# Altium project rtls_tag.PrjPcb
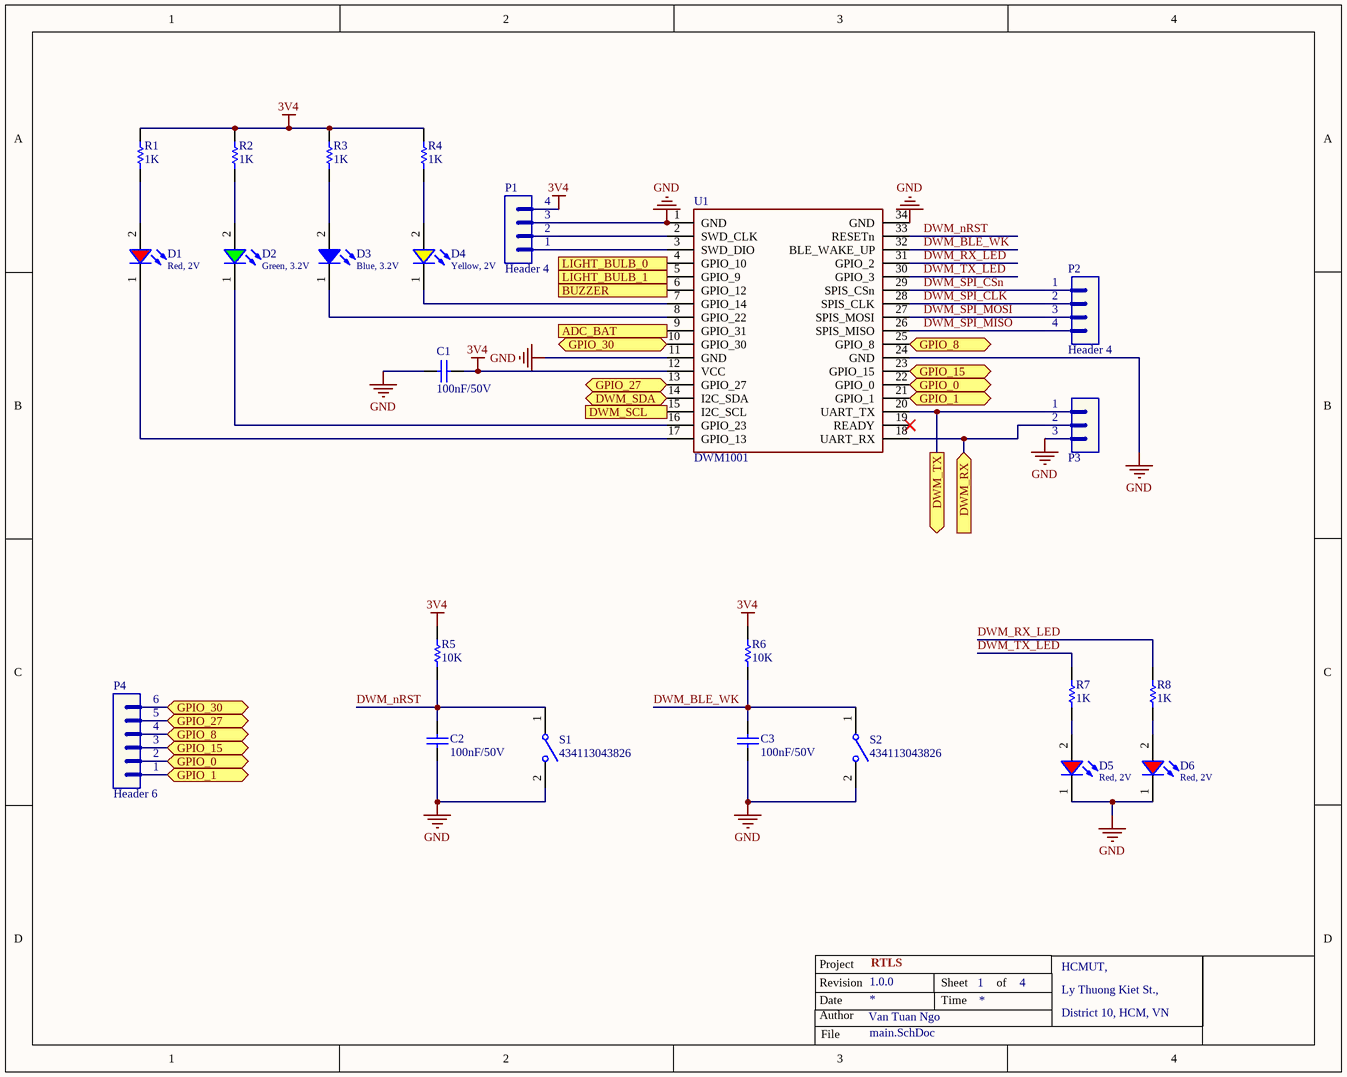
[diagram p0: main.SchDoc]
4 sheets, 85 parts. Net scope: flat (ports and power ports of the same name join across sheets).
Board file: rtls_tag.PcbDoc
Sheets:
  main.SchDoc
  power_supply.SchDoc
  serial.SchDoc
  wifi.SchDoc

## Sheet main.SchDoc
size OrCAD A; DrawnBy: Van Tuan Ngo; Organization: PIF Club; Address1: HCMUT,; Address2: Ly Thuong Kiet St.,; Address3: District 10, HCM, VN; DocumentNumber: 1; Revision: 1.0.0; SheetNumber: 1; SheetTotal: 4; Project: RTLS

### Parts
C1  value 100nF/50V  [CAP-SM-0805]  (hidden comment: Cap-100nF-50V-0805)
C2  value 100nF/50V  [CAP-SM-0805]  (hidden comment: Cap-100nF-50V-0805)
C3  value 100nF/50V  [CAP-SM-0805]  (hidden comment: Cap-100nF-50V-0805)
D1  Red, 2V  [WL-SMCW_0805]
D2  Green, 3.2V  [WL-SMCW_0805]
D3  Blue, 3.2V  [WL-SMCW_0805]
D4  Yellow, 2V  [WL-SMCW_0805]
D5  Red, 2V  [WL-SMCW_0805]
D6  Red, 2V  [WL-SMCW_0805]
P1  Header 4  [JP4]
P2  Header 4  [JP4]
P3  Header 3  [JP3]  (value not drawn)
P4  Header 6  [JP6]
R1  value 1K  [RES-SM-0805]  (hidden comment: Res-1K-0805)
R2  value 1K  [RES-SM-0805]  (hidden comment: Res-1K-0805)
R3  value 1K  [RES-SM-0805]  (hidden comment: Res-1K-0805)
R4  value 1K  [RES-SM-0805]  (hidden comment: Res-1K-0805)
R5  value 10K  [RES-SM-0805]  (hidden comment: Res-10k-0805)
R6  value 10K  [RES-SM-0805]  (hidden comment: Res-10k-0805)
R7  value 1K  [RES-SM-0805]  (hidden comment: Res-1K-0805)
R8  value 1K  [RES-SM-0805]  (hidden comment: Res-1K-0805)
S1  434113043826  [434113043826]
S2  434113043826  [434113043826]
U1  DWM1001  [DWM1001]

### Ports
ADC_BAT (in), BUZZER (out), DWM_RX (in), DWM_SCL (out), DWM_SDA (bidir), DWM_TX (out), GPIO_0 (bidir), GPIO_1 (bidir), GPIO_8 (bidir), GPIO_15 (bidir), GPIO_27 (bidir), GPIO_30 (bidir), LIGHT_BULB_0 (out), LIGHT_BULB_1 (out)

### Nets
3V4: C1.2 P1.4 R1.1 R2.1 R3.1 R4.1 R5.2 R6.2 U1.12(VCC)
GND: C1.1 C2.1 C3.1 D5.1(K) D6.1(K) P1.3 P3.3 S1.2 S2.2 U1.1(GND) U1.11(GND) U1.24(GND) U1.34(GND)
DWM_BLE_WK: C3.2 R6.1 S2.1 U1.32(BLE_WAKE_UP)
DWM_nRST: C2.2 R5.1 S1.1 U1.33(RESETn)
DWM_RX_LED: R8.1 U1.31(GPIO_2)
DWM_SPI_CLK: P2.2 U1.28(SPIS_CLK)
DWM_SPI_CSn: P2.1 U1.29(SPIS_CSn)
DWM_SPI_MISO: P2.4 U1.26(SPIS_MISO)
DWM_SPI_MOSI: P2.3 U1.27(SPIS_MOSI)
DWM_TX_LED: R7.1 U1.30(GPIO_3)
ESP_TX: P3.2 U1.18(UART_RX) ; port DWM_RX
NetD1_1: D1.1(K) U1.17(GPIO_13)
NetD1_2: D1.2(A) R1.2
NetD2_1: D2.1(K) U1.16(GPIO_23)
NetD2_2: D2.2(A) R2.2
NetD3_1: D3.1(K) U1.8(GPIO_22)
NetD3_2: D3.2(A) R3.2
NetD4_1: D4.1(K) U1.7(GPIO_14)
NetD4_2: D4.2(A) R4.2
NetD5_2: D5.2(A) R7.2
NetD6_2: D6.2(A) R8.2
NetP1_1: P1.1 U1.3(SWD_DIO)
NetP1_2: P1.2 U1.2(SWD_CLK)
NetP3_1: P3.1 U1.20(UART_TX) ; port DWM_TX
NetP4_1: P4.1 U1.21(GPIO_1) ; port GPIO_1
NetP4_2: P4.2 U1.22(GPIO_0) ; port GPIO_0
NetP4_3: P4.3 U1.23(GPIO_15) ; port GPIO_15
NetP4_4: P4.4 U1.25(GPIO_8) ; port GPIO_8
NetP4_5: P4.5 U1.13(GPIO_27) ; port GPIO_27
NetP4_6: P4.6 U1.10(GPIO_30) ; port GPIO_30
NetR17_1: U1.9(GPIO_31) ; port ADC_BAT
NetU1_4: U1.4(GPIO_10) ; port LIGHT_BULB_0
NetU1_5: U1.5(GPIO_9) ; port LIGHT_BULB_1
NetU1_6: U1.6(GPIO_12) ; port BUZZER
NetU1_14: U1.14(I2C_SDA) ; port DWM_SDA
NetU1_15: U1.15(I2C_SCL) ; port DWM_SCL

Not connected (* = marked no-connect by the designer): U1 19(READY)*

### Notes on the sheet
- Project
- Revision
- Date
- Author
- Sheet
- Time
- of
- File

### Library data of the parts
C1-C3 = Cap-100nF-50V-0805: CAP CER 0.1UF 50V Y5V 0805; Manufacturer: Samsung Electro-Mechanics; Manufacturer Part Number: CL21F104ZBCNNNC; Local Supplier: thegioiic; Local Supplier Link: https://www.thegioiic.com/products/tu-gom-0805-100nf-0-1uf-50v; Supplier 1: Digikey; Supplier 1 Part Number: 1276-1007-1-ND; Supplier 1 Link: https://www.digikey.com/product-detail/en/samsung-electro-mechanics/CL21F104ZBCNNNC/1276-1007-1-ND/3889093
D1 D5 D6 = 150080RS75000: WL-SMCW SMT Mono-color Chip LED Waterclear, size 0805, Red, 2V, 140deg; Chip Technology: AlInGaP; Dominant Wavelength typ.: 625nm; Luminous Intensity typ.: 150mcd; Peak Wavelength typ.: 630nm; Viewing Angle: 140deg; ComponentLink1Description: Manufacturer; ComponentLink1URL: http://www.we-online.de; ComponentLink2URL: https://www.we-online.com/catalog/datasheet/150080RS75000.pdf; ComponentLink2Description: Datasheet; Forward Voltage typ.: 2V; Emitting Color: Red; Mounting Technology: SMT; Operating Temperature: -40 to +85degC; Published Date: December 2019; Part Number: 150080RS75000; Packaging: Tape and Reel; Size: 0805; Publisher: Wurth Elektronik
D2 = 150080GS75000: WL-SMCW SMT Mono-color Chip LED Waterclear, size 0805, Green, 3.2V, 140deg; Chip Technology: InGaN; Dominant Wavelength typ.: 525nm; Luminous Intensity typ.: 450mcd; Peak Wavelength typ.: 515nm; Viewing Angle: 140deg; ComponentLink1Description: Manufacturer; ComponentLink1URL: http://www.we-online.de; ComponentLink2URL: https://www.we-online.com/catalog/datasheet/150080GS75000.pdf; ComponentLink2Description: Datasheet; Forward Voltage typ.: 3.2V; Emitting Color: Green; Mounting Technology: SMT; Operating Temperature: -40 to +85degC; Published Date: December 2019; Part Number: 150080GS75000; Packaging: Tape and Reel; Size: 0805; Publisher: Wurth Elektronik
D3 = 150080BS75000: WL-SMCW SMT Mono-color Chip LED Waterclear, size 0805, Blue, 3.2V, 140deg; Chip Technology: InGaN; Dominant Wavelength typ.: 470nm; Luminous Intensity typ.: 145mcd; Peak Wavelength typ.: 465nm; Viewing Angle: 140deg; ComponentLink1Description: Manufacturer; ComponentLink1URL: http://www.we-online.de; ComponentLink2URL: https://www.we-online.com/catalog/datasheet/150080BS75000.pdf; ComponentLink2Description: Datasheet; Forward Voltage typ.: 3.2V; Emitting Color: Blue; Mounting Technology: SMT; Operating Temperature: -40 to +85degC; Published Date: December 2019; Part Number: 150080BS75000; Packaging: Tape and Reel; Size: 0805; Publisher: Wurth Elektronik
D4 = 150080YS75000: WL-SMCW SMT Mono-color Chip LED Waterclear, size 0805, Yellow, 2V, 140deg; Chip Technology: AlInGaP; Dominant Wavelength typ.: 590nm; Luminous Intensity typ.: 120mcd; Peak Wavelength typ.: 595nm; Viewing Angle: 140deg; ComponentLink1Description: Manufacturer; ComponentLink1URL: http://www.we-online.de; ComponentLink2URL: https://www.we-online.com/catalog/datasheet/150080YS75000.pdf; ComponentLink2Description: Datasheet; Forward Voltage typ.: 2V; Emitting Color: Yellow; Mounting Technology: SMT; Operating Temperature: -40 to +85degC; Published Date: December 2019; Part Number: 150080YS75000; Packaging: Tape and Reel; Size: 0805; Publisher: Wurth Elektronik
P1 P2 = Header 4: Header, 4-Pin; LatestRevisionDate: 17-Jul-2002; LatestRevisionNote: Re-released for DXP Platform.; Publisher: Altium Limited; Local Supplier: thegioiic; Local Supplier Part Number: x; Local Supplier Link: https://www.thegioiic.com/products/hang-rao-duc-don-2-54mm-40-chan-1-hang-cao-11-4mm-xuyen-lo
P3 = Header 3: Header, 3-Pin; LatestRevisionDate: 17-Jul-2002; LatestRevisionNote: Re-released for DXP Platform.; Publisher: Altium Limited; Local Supplier: thegioiic; Local Supplier Part Number: x; Local Supplier Link: https://www.thegioiic.com/products/hang-rao-duc-don-2-54mm-40-chan-1-hang-cao-11-4mm-xuyen-lo
P4 = Header 6: Header, 6-Pin; LatestRevisionDate: 17-Jul-2002; LatestRevisionNote: Re-released for DXP Platform.; Publisher: Altium Limited; Local Supplier Link: https://www.thegioiic.com/products/hang-rao-duc-don-2-54mm-40-chan-1-hang-cao-11-4mm-xuyen-lo; Local Supplier: thegioiic; Local Supplier Part Number: x
R1-R4 R7 R8 = Res-1K-0805: RES 1K OHM 1% 1/4W 0805; Manufacturer: Stackpole Electronics Inc; Manufacturer Part Number: RNCP0805FTD1K00; Local Supplier: thegioiic; Local Supplier Link: https://www.thegioiic.com/products/dien-tro-1-kohm-0805-5; Supplier 1: Digikey; Supplier 1 Link: https://www.digikey.com/product-detail/en/stackpole-electronics-inc/RNCP0805FTD1K00/RNCP0805FTD1K00CT-ND/2240568; Supplier 1 Part Number: RNCP0805FTD1K00CT-ND
R5 R6 = Res-10k-0805: RES 10K OHM 1% 1/4W 0805; Manufacturer: Stackpole Electronics Inc; Manufacturer Part Number: RNCP0805FTD10K0; Local Supplier: thegioiic; Local Supplier Link: https://www.thegioiic.com/products/dien-tro-10-kohm-0805-5; Supplier 1: Digikey; Supplier 1 Link: https://www.digikey.com/product-detail/en/stackpole-electronics-inc/RNCP0805FTD10K0/RNCP0805FTD10K0CT-ND/2240601; Supplier 1 Part Number: RNCP0805FTD10K0CT-ND
S1 S2 = 434113043826: WS-TASV J-Bend SMT Tact Switch 6x3.5mm, height 4.3mm, 260gf; Rated Voltage: 12VDC; Rated Current: 50mA; Washable: No; ComponentLink1Description: Manufacturer; ComponentLink1URL: http://www.we-online.de; ComponentLink2Description: Datasheet; ComponentLink2URL: https://katalog.we-online.com/em/datasheet/434113043826.pdf; Operating Temperature: -40 to +85degC; Part Number: 434113043826; Published Date: September 2019; Contact Material: Stainless Steel; Height: 4.3mm; Mounting Technology: SMT; Contact Plating: Silver; Operation Force: 260gf; Packaging: Tape and Reel; Terminal Material: Copper Alloy; Publisher: Wurth Elektronik; Terminal Plating: Silver; Local Supplier: thegioiic; Local Supplier Link: https://www.thegioiic.com/products/nut-nhan-3-5x6mm-cao-5mm-2-chan-smd-dau-trang; Local Supplier Part Number: x
U1 = DWM1001: Local Supplier: x; Local Supplier Part Number: x; Local Supplier Link: x

## Sheet power_supply.SchDoc
size OrCAD A; DrawnBy: Van Tuan Ngo; Organization: PIF Club; Address1: HCMUT,; Address2: Ly Thuong Kiet St.,; Address3: District 10, HCM, VN; DocumentNumber: 2; Revision: 1.0.0; SheetNumber: 2; SheetTotal: 4; Project: RTLS
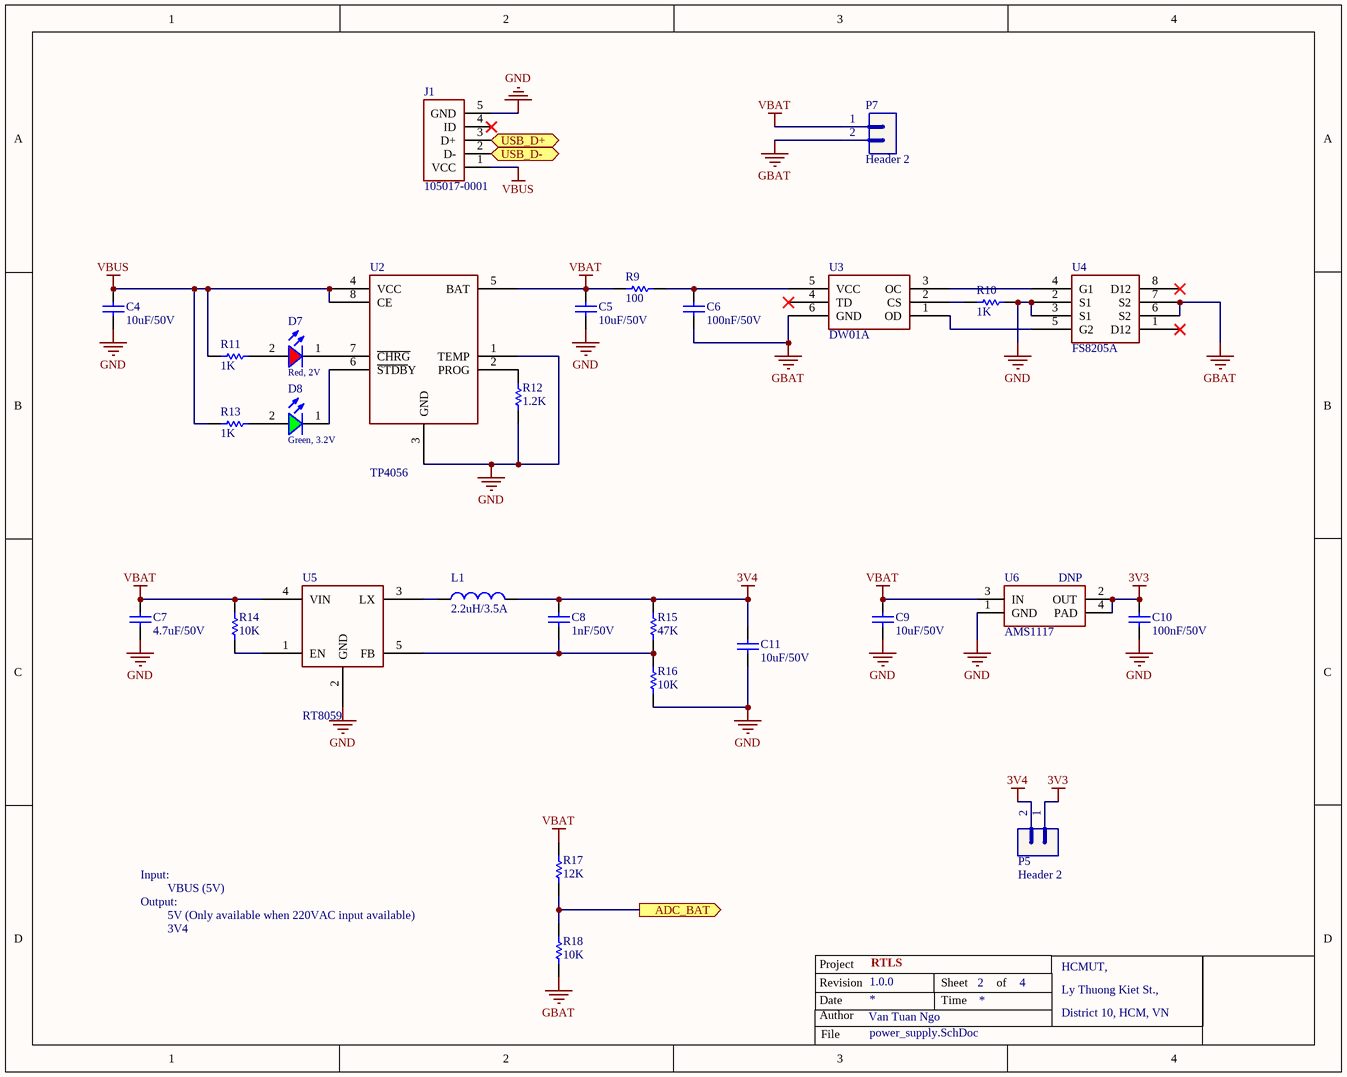
[diagram p1: power_supply.SchDoc]

### Parts
C4  value 10uF/50V  [CAP-SM-0805]  (hidden comment: Cap-10uF-50V-0805)
C5  value 10uF/50V  [CAP-SM-0805]  (hidden comment: Cap-10uF-50V-0805)
C6  value 100nF/50V  [CAP-SM-0805]  (hidden comment: Cap-100nF-50V-0805)
C7  value 4.7uF/50V  [CAP-SM-0805]  (hidden comment: Cap-4.7uF-50V-0805)
C8  value 1nF/50V  [CAP-SM-0805]  (hidden comment: Cap-22pF-50V-0805)
C9  value 10uF/50V  [CAP-SM-0805]  (hidden comment: Cap-10uF-50V-0805)
C10  value 100nF/50V  [CAP-SM-0805]  (hidden comment: Cap-100nF-50V-0805)
C11  value 10uF/50V  [CAP-SM-0805]  (hidden comment: Cap-10uF-50V-0805)
D7  Red, 2V  [WL-SMCW_0805]
D8  Green, 3.2V  [WL-SMCW_0805]
J1  105017-0001  [Micro-USB-Female]
L1  2.2uH/3.5A  [CD53]
P5  Header 2  [JP2]
P7  Header 2  [JP2]
R9  value 100  [RES-SM-0805]  (hidden comment: Res-100-0805)
R10  value 1K  [RES-SM-0805]  (hidden comment: Res-1K-0805)
R11  value 1K  [RES-SM-0805]  (hidden comment: Res-1K-0805)
R12  value 1.2K  [RES-SM-0805]  (hidden comment: Res-1.2K-0805)
R13  value 1K  [RES-SM-0805]  (hidden comment: Res-1K-0805)
R14  value 10K  [RES-SM-0805]  (hidden comment: Res-10k-0805)
R15  value 47K  [RES-SM-0805]  (hidden comment: Res-47K-0805)
R16  value 10K  [RES-SM-0805]  (hidden comment: Res-10k-0805)
R17  value 12K  [RES-SM-0805]  (hidden comment: Res-12K-0805)
R18  value 10K  [RES-SM-0805]  (hidden comment: Res-10k-0805)
U2  TP4056  [SOP8]
U3  DW01A  [SOT-23-6]
U4  FS8205A  [TSSOP8]
U5  RT8059  [SOT-23-5]
U6  AMS1117  [SOT223]

### Ports
ADC_BAT (out), USB_D+ (bidir), USB_D- (bidir)

### Nets
3V3: C10.2 P5.1 U6.2(OUT) U6.4(PAD)
3V4: C8.2 C11.2 L1.2 P5.2 R15.2
GBAT: C6.1 P7.2 R18.1 U3.6(GND) U4.6(S2) U4.7(S2)
GND: C4.1 C5.1 C7.1 C9.1 C10.1 C11.1 J1.5(GND) R10.2 R12.1 R16.1 U2.1(TEMP) U2.3(GND) U4.2(S1) U4.3(S1) U5.2(GND) U6.1(GND)
VBAT: C5.2 C7.2 C9.2 P7.1 R9.1 R14.2 R17.2 U2.5(BAT) U5.4(VIN) U6.3(IN)
VBUS: C4.2 J1.1(VCC) R11.1 R13.1 U2.4(VCC) U2.8(CE)
NetC6_2: C6.2 R9.2 U3.5(VCC)
NetC8_1: C8.1 R15.1 R16.2 U5.5(FB)
NetD7_1: D7.1(K) U2.7(~{CHRG})
NetD7_2: D7.2(A) R11.2
NetD8_1: D8.1(K) U2.6(~{STDB}Y)
NetD8_2: D8.2(A) R13.2
NetJ1_2: J1.2(D-) ; port USB_D-
NetJ1_3: J1.3(D+) ; port USB_D+
NetL1_1: L1.1 U5.3(LX)
NetR10_1: R10.1 U3.2(CS)
NetR12_2: R12.2 U2.2(PROG)
NetR14_1: R14.1 U5.1(EN)
NetR17_1: R17.1 R18.2 ; port ADC_BAT
NetU3_1: U3.1(OD) U4.5(G2)
NetU3_3: U3.3(OC) U4.4(G1)

Not connected (* = marked no-connect by the designer): J1 4(ID)*; U3 4(TD)*; U4 1(D12)* 8(D12)*

### Notes on the sheet
- (near U6) DNP
- Input:
- VBUS (5V)
- Output:
- 3V4
- 5V (Only available when 220VAC input available)
- Project
- Revision
- Date
- Author
- Sheet
- Time
- of
- File

### Library data of the parts
C4 C5 C9 C11 = Cap-10uF-50V-0805: CAP CER 10UF 50V X5R 0805; Manufacturer: Yageo; Manufacturer Part Number: CC0805KKX5R9BB106; Local Supplier: thegioiic; Local Supplier Link: https://www.thegioiic.com/products/tu-gom-0805-10uf-50v; Supplier 1: Digikey; Supplier 1 Link: https://www.digikey.com/product-detail/en/yageo/CC0805KKX5R9BB106/311-3499-2-ND/7164383; Supplier 1 Part Number: 311-3499-2-ND
C6 C10 = Cap-100nF-50V-0805: as C1 on sheet main; Local Supplier: thegioiic; Local Supplier Link: https://www.thegioiic.com/products/tu-gom-0805-100nf-0-1uf-50v; Supplier 1: Digikey; Supplier 1 Part Number: 1276-1007-1-ND; Supplier 1 Link: https://www.digikey.com/product-detail/en/samsung-electro-mechanics/CL21F104ZBCNNNC/1276-1007-1-ND/3889093
C7 = Cap-4.7uF-50V-0805: CAP CER 4.7UF 50V X5R 0805; Manufacturer: Murata Electronics; Manufacturer Part Number: GRM21BR61H475KE51L; Local Supplier: thegioiic; Local Supplier Link: https://thegioiic.com/products/tu-4-7uf-50v-0805-cap; Supplier 1: Digikey; Supplier 1 Link: https://www.digikey.com/product-detail/en/murata-electronics/GRM21BR61H475KE51L/490-10751-1-ND/5251349; Supplier 1 Part Number: 490-10751-1-ND
C8 = Cap-22pF-50V-0805: CAP CER 22PF 100V X7R 0805; Manufacturer: Johanson Dielectrics Inc.; Manufacturer Part Number: 101X15W102MV4E; Local Supplier: thegioiic; Local Supplier Link: https://thegioiic.com/products/tu-1nf-50v-0805; Supplier 1: Digikey; Supplier 1 Link: https://www.digikey.com/product-detail/en/johanson-dielectrics-inc/101X15W102MV4E/709-1335-1-ND/2327235; Supplier 1 Part Number: 709-1335-1-ND
D7 = 150080RS75000: as D1 on sheet main; Viewing Angle: 140deg; ComponentLink1Description: Manufacturer; ComponentLink1URL: http://www.we-online.de; ComponentLink2URL: https://www.we-online.com/catalog/datasheet/150080RS75000.pdf; ComponentLink2Description: Datasheet; Forward Voltage typ.: 2V; Emitting Color: Red; Mounting Technology: SMT; Operating Temperature: -40 to +85degC; Published Date: December 2019; Part Number: 150080RS75000; Packaging: Tape and Reel; Size: 0805; Publisher: Wurth Elektronik
D8 = 150080GS75000: as D2 on sheet main; Viewing Angle: 140deg; ComponentLink1Description: Manufacturer; ComponentLink1URL: http://www.we-online.de; ComponentLink2URL: https://www.we-online.com/catalog/datasheet/150080GS75000.pdf; ComponentLink2Description: Datasheet; Forward Voltage typ.: 3.2V; Emitting Color: Green; Mounting Technology: SMT; Operating Temperature: -40 to +85degC; Published Date: December 2019; Part Number: 150080GS75000; Packaging: Tape and Reel; Size: 0805; Publisher: Wurth Elektronik
J1 = Micro-USB-Female: CONN RCPT USB2.0 MICRO B SMD R/A; Vendor: Molex Connector Corporation; Built_By: EMA_Cory; SourceLibrary: Molex_2020-05-26; Datasheet: https://www.molex.com/pdm_docs/sd/1050170001_sd.pdf; Manufacturer_Part_Number: 105017-0001; Copyright: Copyright (C) 2018 Accelerated Designs. All rights reserved; RefDes: RefDes; Type: DEV; Local Supplier: thegioiic; Local Supplier Part Number: x; Local Supplier Link: https://www.thegioiic.com/products/cong-usb-micro-b-2-0-dau-cai-5-chan-smd-v1
L1 = ind-2.2uH-3.5A-CD53
P5 P7 = Header 2: Header, 2-Pin; LatestRevisionDate: 17-Jul-2002; LatestRevisionNote: Re-released for DXP Platform.; Publisher: Altium Limited; Local Supplier: thegioiic; Local Supplier Part Number: x; Local Supplier Link: https://www.thegioiic.com/products/hang-rao-duc-don-2-54mm-40-chan-1-hang-cao-11-4mm-xuyen-lo
R9 = Res-100-0805: RES 100 OHM 0.1% 1/5W 0805; Manufacturer: Vishay Thin Film; Manufacturer Part Number: PTN0805E10R0BST1; Local Supplier: thegioiic; Local Supplier Link: https://thegioiic.com/products/dien-tro-10-ohm-0805-5; Supplier 1: Digikey; Supplier 1 Link: https://www.digikey.com/product-detail/en/vishay-thin-film/PTN0805E10R0BST1/764-1471-1-ND/7103255; Supplier 1 Part Number: 764-1471-1-ND
R10 R11 R13 = Res-1K-0805: as R1 on sheet main; Local Supplier: thegioiic; Local Supplier Link: https://www.thegioiic.com/products/dien-tro-1-kohm-0805-5; Supplier 1: Digikey; Supplier 1 Link: https://www.digikey.com/product-detail/en/stackpole-electronics-inc/RNCP0805FTD1K00/RNCP0805FTD1K00CT-ND/2240568; Supplier 1 Part Number: RNCP0805FTD1K00CT-ND
R12 = Res-1.2K-0805: RES SMD 1.2K OHM 1% 1/8W 0805; Manufacturer: TE Connectivity Passive Product; Manufacturer Part Number: CRG0805F1K2; Local Supplier: thegioiic; Local Supplier Link: https://thegioiic.com/products/dien-tro-1-2k-ohm-0805-5; Supplier 1: Digikey; Supplier 1 Link: https://www.digikey.com/product-detail/en/te-connectivity-passive-product/CRG0805F1K2/A126346CT-ND/7603401; Supplier 1 Part Number: A126346CT-ND
R14 R16 R18 = Res-10k-0805: as R5 on sheet main; Local Supplier: thegioiic; Local Supplier Link: https://www.thegioiic.com/products/dien-tro-10-kohm-0805-5; Supplier 1: Digikey; Supplier 1 Link: https://www.digikey.com/product-detail/en/stackpole-electronics-inc/RNCP0805FTD10K0/RNCP0805FTD10K0CT-ND/2240601; Supplier 1 Part Number: RNCP0805FTD10K0CT-ND
R15 = Res-47K-0805: RES SMD 47K OHM 1% 1/8W 0805; Manufacturer: Yageo; Manufacturer Part Number: RC0805FR-0747KL; Local Supplier: thegioiic; Local Supplier Link: https://thegioiic.com/products/dien-tro-47k-ohm-0603-5; Supplier 1: Digikey; Supplier 1 Part Number: 311-47.0KCRCT-ND; Supplier 1 Link: https://www.digikey.com/product-detail/en/yageo/RC0805FR-0747KL/311-47.0KCRCT-ND/730920
R17 = Res-12K-0805: RES 12 KOHM JUMPER 0805; Manufacturer: Vishay Thin Film; Manufacturer Part Number: PAT0805E3121BST1; Local Supplier: icdayroi; Local Supplier Link: https://icdayroi.com/dien-tro-12k-0805-1-goi-50-con; Supplier 1: Digikey; Supplier 1 Link: https://www.digikey.com/product-detail/en/vishay-thin-film/PAT0805E3121BST1/PAT0805E3121BST1-ND/2281536; Supplier 1 Part Number: PAT0805E3121BST1-ND
U2 = TP4056: Linear charger for single cell / lithium-ion batteries
U3 = DW01A: Battery protection IC
U5 = RT8059: High efficiency PWM step-down DC/DC converter
U6 = AMS1117: Available in 1.8V, 2.5V, 2.85V, 3.3V, 5V, and  Adjustable Versions; Local Supplier: thegioiic; Local Supplier Part Number: *; Local Supplier Link: https://www.thegioiic.com/products/ams1117-3-3v

## Sheet serial.SchDoc
size OrCAD A; DrawnBy: Van Tuan Ngo; Organization: PIF Club; Address1: HCMUT,; Address2: Ly Thuong Kiet St.,; Address3: District 10, HCM, VN; DocumentNumber: 4; Revision: 1.0.0; SheetNumber: 4; SheetTotal: 4; Project: RTLS
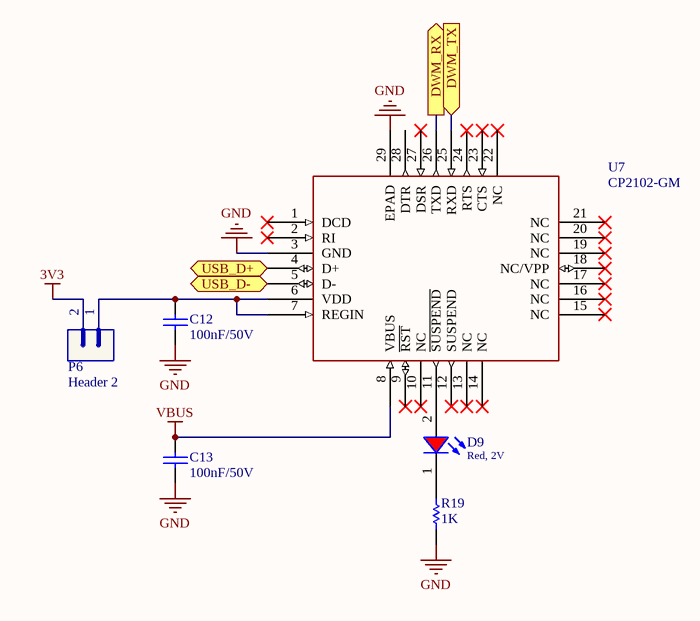
[diagram p2: serial.SchDoc]

### Parts
C12  value 100nF/50V  [CAP-SM-0805]  (hidden comment: Cap-100nF-50V-0805)
C13  value 100nF/50V  [CAP-SM-0805]  (hidden comment: Cap-100nF-50V-0805)
D9  Red, 2V  [WL-SMCW_0805]
P6  Header 2  [JP2]
R19  value 1K  [RES-SM-0805]  (hidden comment: Res-1K-0805)
U7  CP2102-GM  [QFN28_5X5_SIL]

### Ports
DWM_RX (out), DWM_TX (in), USB_D+ (bidir), USB_D- (bidir)

### Nets
3V3: P6.2
GND: C12.1 C13.1 R19.1 U7.3(GND) U7.29(EPAD)
VBUS: C13.2 U7.8(VBUS)
ESP_TX: U7.26(TXD) ; port DWM_RX
NetC12_2: C12.2 P6.1 U7.6(VDD) U7.7(REGIN)
NetD9_1: D9.1(K) R19.2
NetD9_2: D9.2(A) U7.11(~{SUSPEND})
NetJ1_2: U7.5(D-) ; port USB_D-
NetJ1_3: U7.4(D+) ; port USB_D+
NetP3_1: U7.25(RXD) ; port DWM_TX

Not connected (* = marked no-connect by the designer): U7 1(DCD)* 2(RI)* 9(~{RST})* 10(NC)* 12(SUSPEND)* 13(NC)* 14(NC)* 15(NC)* 16(NC)* 17(NC)* 18(NC/VPP)* 19(NC)* 20(NC)* 21(NC)* 22(NC)* 23(CTS)* 24(RTS)* 27(DSR)* 28(DTR)

### Notes on the sheet
- Project
- Revision
- Date
- Author
- Sheet
- Time
- of
- File

### Library data of the parts
C12 C13 = Cap-100nF-50V-0805: as C1 on sheet main; Local Supplier: thegioiic; Local Supplier Link: https://thegioiic.com/products/tu-100nf-0-1uf-50v-0805; Supplier 1: Digikey; Supplier 1 Part Number: 1276-1007-1-ND; Supplier 1 Link: https://www.digikey.com/product-detail/en/samsung-electro-mechanics/CL21F104ZBCNNNC/1276-1007-1-ND/3889093
D9 = 150080RS75000: as D1 on sheet main; Viewing Angle: 140deg; ComponentLink1Description: Manufacturer; ComponentLink1URL: http://www.we-online.de; ComponentLink2URL: https://www.we-online.com/catalog/datasheet/150080RS75000.pdf; ComponentLink2Description: Datasheet; Forward Voltage typ.: 2V; Emitting Color: Red; Mounting Technology: SMT; Operating Temperature: -40 to +85degC; Published Date: December 2019; Part Number: 150080RS75000; Packaging: Tape and Reel; Size: 0805; Publisher: Wurth Elektronik
P6 = Header 2: Header, 2-Pin; LatestRevisionDate: 17-Jul-2002; LatestRevisionNote: Re-released for DXP Platform.; Publisher: Altium Limited; Local Supplier: thegioiic; Local Supplier Part Number: x; Local Supplier Link: https://www.thegioiic.com/products/hang-rao-duc-don-2-54mm-40-chan-1-hang-cao-11-4mm-xuyen-lo
R19 = Res-1K-0805: as R1 on sheet main; Local Supplier: thegioiic; Local Supplier Link: https://www.thegioiic.com/products/dien-tro-1-kohm-0805-5; Supplier 1: Digikey; Supplier 1 Link: https://www.digikey.com/product-detail/en/stackpole-electronics-inc/RNCP0805FTD1K00/RNCP0805FTD1K00CT-ND/2240568; Supplier 1 Part Number: RNCP0805FTD1K00CT-ND
U7 = CP2102-GM: Vendor: Silicon Labs; Built_By: EMA_UL_Team; SourceLibrary: Silicon_Labs_2015-03-23; Manufacturer_Part_Number: CP2102-GM; Copyright: Copyright (C) 2018 Accelerated Designs. All rights reserved; RefDes: RefDes; Type: DEV; Local Supplier: thegioiic; Local Supplier Part Number: *; Local Supplier Link: https://www.thegioiic.com/products/cp2102

## Sheet wifi.SchDoc
size A4; DrawnBy: Van Tuan Ngo; Organization: PIF Club; Address1: 304B1, HCMUT,; Address2: Ly Thuong Kiet St.,; Address3: District 10, HCM, VN; DocumentNumber: 6; Revision: 1.0.0; SheetNumber: 6; SheetTotal: 8; Project: PIFWRobot
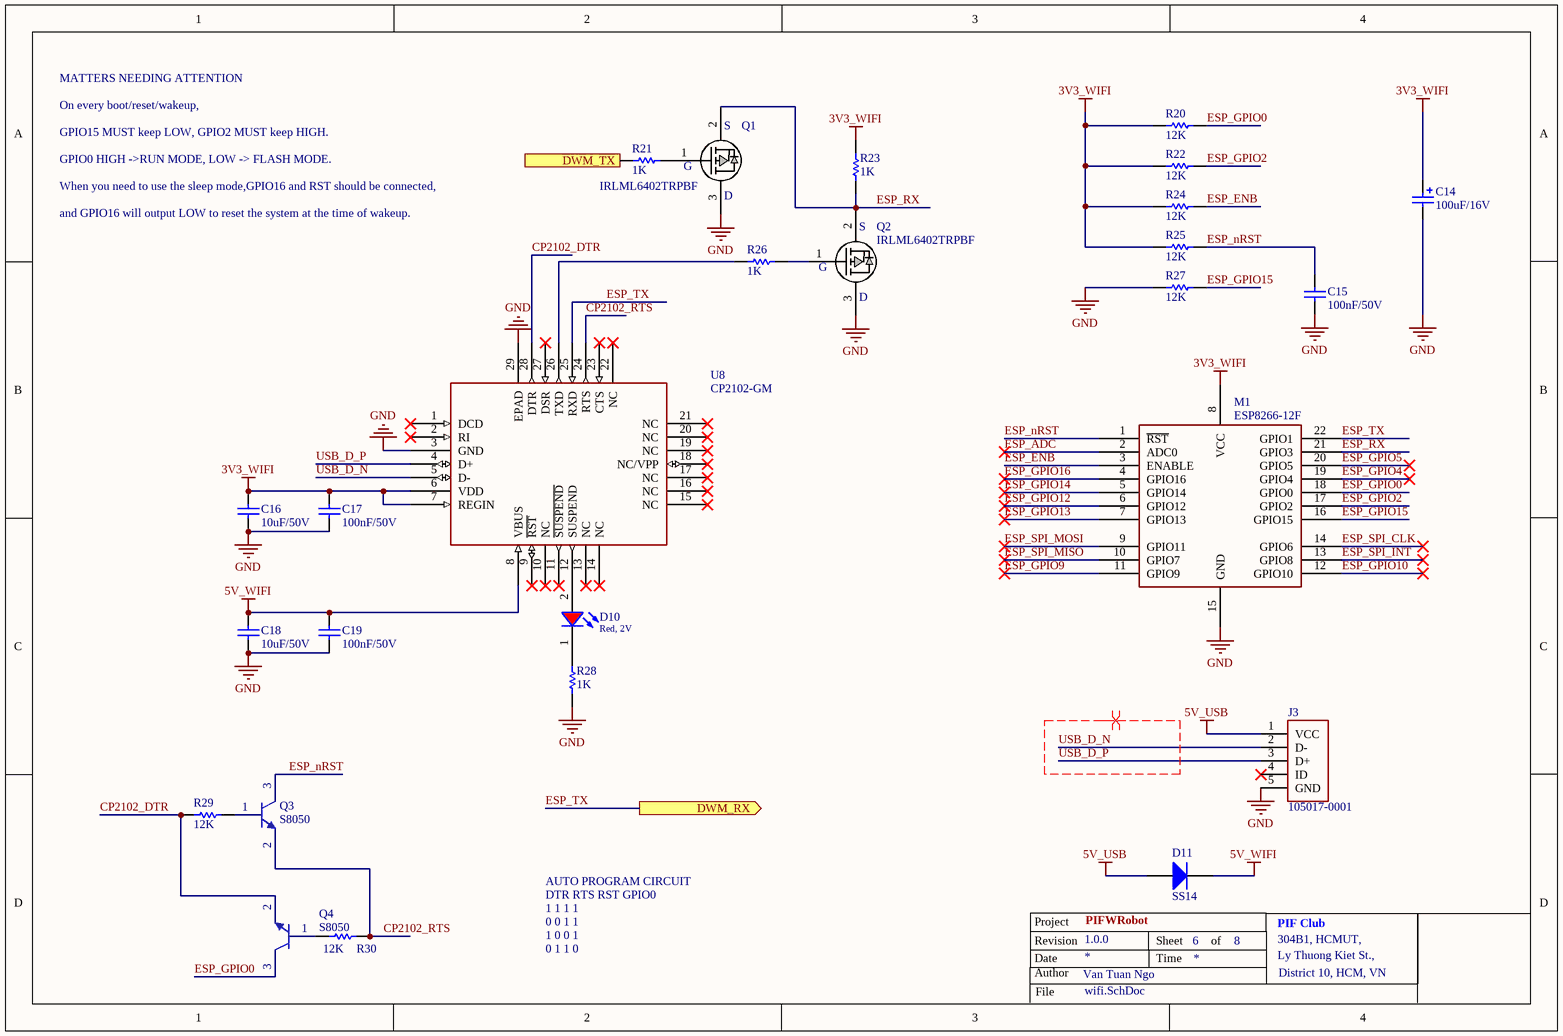
[diagram p3: wifi.SchDoc]

### Parts
C14  value 100uF/16V  [CAP_SM_TAN]  (hidden comment: TAJB107M006RNJ)
C15  value 100nF/50V  [CAP-SM-0805]  (hidden comment: Cap-100nF-50V-0805)
C16  value 10uF/50V  [CAP-SM-0805]  (hidden comment: Cap-10uF-50V-0805)
C17  value 100nF/50V  [CAP-SM-0805]  (hidden comment: Cap-100nF-50V-0805)
C18  value 10uF/50V  [CAP-SM-0805]  (hidden comment: Cap-10uF-50V-0805)
C19  value 100nF/50V  [CAP-SM-0805]  (hidden comment: Cap-100nF-50V-0805)
D10  Red, 2V  [WL-SMCW_0805]
D11  SS14  [SS14]
J3  105017-0001  [Micro-USB-Female]
M1  ESP8266-12F  [ESP8266-12F]
Q1  IRLML6402TRPBF  [SOT23_NEX]
Q2  IRLML6402TRPBF  [SOT23_NEX]
Q3  S8050  [SOT23_NEX]
Q4  S8050  [SOT23_NEX]
R20  value 12K  [RES-SM-0805]  (hidden comment: Res-12K-0805)
R21  value 1K  [RES-SM-0805]  (hidden comment: Res-1K-0805)
R22  value 12K  [RES-SM-0805]  (hidden comment: Res-12K-0805)
R23  value 1K  [RES-SM-0805]  (hidden comment: Res-1K-0805)
R24  value 12K  [RES-SM-0805]  (hidden comment: Res-12K-0805)
R25  value 12K  [RES-SM-0805]  (hidden comment: Res-12K-0805)
R26  value 1K  [RES-SM-0805]  (hidden comment: Res-1K-0805)
R27  value 12K  [RES-SM-0805]  (hidden comment: Res-12K-0805)
R28  value 1K  [RES-SM-0805]  (hidden comment: Res-1K-0805)
R29  value 12K  [RES-SM-0805]  (hidden comment: Res-12K-0805)
R30  value 12K  [RES-SM-0805]  (hidden comment: Res-12K-0805)
U8  CP2102-GM  [QFN28_5X5_SIL]

### Ports
DWM_RX (out), DWM_TX (in)

### Nets
3V3_WIFI: C14.1 C16.2 C17.2 M1.8(VCC) R20.1 R22.1 R23.2 R24.1 R25.1 U8.6(VDD) U8.7(REGIN)
5V_USB: D11.2(A) J3.1(VCC)
5V_WIFI: C18.2 C19.2 D11.1(K) U8.8(VBUS)
GND: C14.2 C15.1 C16.1 C17.1 C18.1 C19.1 J3.5(GND) M1.15(GND) Q1.3(D) Q2.3(D) R27.1 R28.1 U8.3(GND) U8.29(EPAD)
CP2102_DTR: Q4.2(E) R29.1 U8.28(DTR)
CP2102_RTS: Q3.2(E) R30.2 U8.24(RTS)
ESP_ADC: M1.2(ADC0)
ESP_ENB: M1.3(ENABLE) R24.2
ESP_GPIO0: M1.18(GPIO0) Q4.3(C) R20.2
ESP_GPIO2: M1.17(GPIO2) R22.2
ESP_GPIO4: M1.19(GPIO4)
ESP_GPIO5: M1.20(GPIO5)
ESP_GPIO9: M1.11(GPIO9)
ESP_GPIO10: M1.12(GPIO10)
ESP_GPIO12: M1.6(GPIO12)
ESP_GPIO13: M1.7(GPIO13)
ESP_GPIO14: M1.5(GPIO14)
ESP_GPIO15: M1.16(GPIO15) R27.2
ESP_GPIO16: M1.4(GPIO16)
ESP_nRST: C15.2 M1.1(~{RST}) Q3.3(C) R25.2
ESP_RX: M1.21(GPIO3) Q1.2(S) Q2.2(S) R23.1
ESP_SPI_CLK: M1.14(GPIO6)
ESP_SPI_INT: M1.13(GPIO8)
ESP_SPI_MISO: M1.10(GPIO7)
ESP_SPI_MOSI: M1.9(GPIO11)
ESP_TX: M1.22(GPIO1) U8.25(RXD) ; port DWM_RX
USB_D_N: J3.2(D-) U8.5(D-)
USB_D_P: J3.3(D+) U8.4(D+)
NetD10_1: D10.1(K) R28.2
NetD10_2: D10.2(A) U8.12(SUSPEND)
NetP3_1: R21.1 ; port DWM_TX
NetQ1_1: Q1.1(G) R21.2
NetQ2_1: Q2.1(G) R26.2
NetQ3_1: Q3.1(B) R29.2
NetQ4_1: Q4.1(B) R30.1
NetR26_1: R26.1 U8.26(TXD)

Not connected (* = marked no-connect by the designer): J3 4(ID)*; U8 1(DCD)* 2(RI)* 9(~{RST})* 10(NC)* 11(~{SUSPEND})* 13(NC)* 14(NC)* 15(NC)* 16(NC)* 17(NC)* 18(NC/VPP)* 19(NC)* 20(NC)* 21(NC)* 22(NC)* 23(CTS)* 27(DSR)*

### Layout directives
differential pair: USB_D_N, USB_D_P

### Notes on the sheet
- MATTERS NEEDING ATTENTION
- On every boot/reset/wakeup,
- GPIO15 MUST keep LOW, GPIO2 MUST keep HIGH.
- GPIO0 HIGH ->RUN MODE, LOW -> FLASH MODE.
- When you need to use the sleep mode,GPIO16 and RST should be connected,
- and GPIO16 will output LOW to reset the system at the time of wakeup.
- AUTO PROGRAM CIRCUIT
- DTR RTS RST GPIO0
- 1 1 1 1
- 0 0 1 1
- 1 0 0 1
- 0 1 1 0
- Project
- Revision
- Date
- Author
- Sheet
- Time
- of
- File

### Library data of the parts
C14 = Cap-Tan-100uF-16V: Manufacturer: Nichicon; Manufacturer Part Number: UWX1C101MCL1GB; Local Supplier: thegioiic; Local Supplier Link: https://www.thegioiic.com/products/tu-tantalum-100uf-16v-2312-tajc107k016rnj; Supplier 1: Digikey; Supplier 1 Part Number: 493-2105-1-ND; Supplier 1 Link: https://www.digikey.com/product-detail/en/nichicon/UWX1C101MCL1GB/493-2105-1-ND/590080
C15 C17 C19 = Cap-100nF-50V-0805: as C1 on sheet main; Local Supplier: thegioiic; Supplier 1: Digikey; Supplier 1 Part Number: 1276-1007-1-ND; Supplier 1 Link: https://www.digikey.com/product-detail/en/samsung-electro-mechanics/CL21F104ZBCNNNC/1276-1007-1-ND/3889093
  C15: Local Supplier Link: https://thegioiic.com/products/tu-100nf-0-1uf-50v-0805
  C17 C19: Local Supplier Link: https://www.thegioiic.com/products/tu-gom-0805-100nf-0-1uf-50v
C16 C18 = Cap-10uF-50V-0805: as C4 on sheet power_supply; Local Supplier: thegioiic; Local Supplier Link: https://www.thegioiic.com/products/tu-gom-0805-10uf-50v; Supplier 1: Digikey; Supplier 1 Link: https://www.digikey.com/product-detail/en/yageo/CC0805KKX5R9BB106/311-3499-2-ND/7164383; Supplier 1 Part Number: 311-3499-2-ND
D10 = 0805-Red: WL-SMCW SMT Mono-color Chip LED Waterclear, size 0805, Red, 2V, 140deg; Part Number: 150080RS75000; Chip Technology: AlInGaP; Dominant Wavelength typ.: 625nm; Luminous Intensity typ.: 150mcd; Peak Wavelength typ.: 630nm; Viewing Angle: 140deg; ComponentLink1Description: Manufacturer; ComponentLink1URL: http://www.we-online.de; ComponentLink2URL: https://www.we-online.com/catalog/datasheet/150080RS75000.pdf; ComponentLink2Description: Datasheet; Forward Voltage typ.: 2V; Emitting Color: Red; Mounting Technology: SMT; Operating Temperature: -40 to +85degC; Published Date: December 2019; Packaging: Tape and Reel; Size: 0805; Publisher: Wurth Elektronik; Local Supplier: thegioiic; Local Supplier Partnumber: x; Local Supplier Link: https://www.thegioiic.com/products/led-do-0805-dan-smd-trong-suot-harvatek
D11 = Diode-SS14: DIODE SCHOTTKY 40V 1A SMA; Manufacturer: ON Semiconductor; Local Supplier: thegioiic; Local Supplier Link: https://www.thegioiic.com/products/ss14-sma-diode-schottky-1a-1n5819; Supplier 1: Digikey; Supplier 1 Link: https://www.digikey.com/product-detail/en/on-semiconductor/SS14/SS14CT-ND/965729; Manufacturer Part Number: SS14; Supplier 1 Part Number: SS14CT-ND
J3 = Micro-USB-Female: as J1 on sheet power_supply; Datasheet: https://www.molex.com/pdm_docs/sd/1050170001_sd.pdf; Manufacturer_Part_Number: 105017-0001; Copyright: Copyright (C) 2018 Accelerated Designs. All rights reserved; RefDes: RefDes; Type: DEV; Local Supplier: thegioiic; Local Supplier Part Number: x; Local Supplier Link: https://www.thegioiic.com/products/cong-usb-micro-b-2-0-dau-cai-5-chan-smd-v1
Q1 Q2 = IRLML6402TRPBF: P-Channel 20V 3.7A (Ta) 1.3W (Ta) Surface Mount Micro3™/SOT-23; Local Supplier: thegioiic; Local Supplier Link: https://www.thegioiic.com/products/irlml6402trpbf; Local Supplier Part Number: *
R20 R22 R24 R25 R27 R29 R30 = Res-12K-0805: as R17 on sheet power_supply; Local Supplier: icdayroi; Local Supplier Link: https://icdayroi.com/dien-tro-12k-0805-1-goi-50-con; Supplier 1: Digikey; Supplier 1 Link: https://www.digikey.com/product-detail/en/vishay-thin-film/PAT0805E3121BST1/PAT0805E3121BST1-ND/2281536; Supplier 1 Part Number: PAT0805E3121BST1-ND
R21 R23 R26 R28 = Res-1K-0805: as R1 on sheet main; Local Supplier: thegioiic; Local Supplier Link: https://www.thegioiic.com/products/dien-tro-1-kohm-0805-5; Supplier 1: Digikey; Supplier 1 Link: https://www.digikey.com/product-detail/en/stackpole-electronics-inc/RNCP0805FTD1K00/RNCP0805FTD1K00CT-ND/2240568; Supplier 1 Part Number: RNCP0805FTD1K00CT-ND
U8 = CP2102-GM: as U7 on sheet serial; Manufacturer_Part_Number: CP2102-GM; Copyright: Copyright (C) 2018 Accelerated Designs. All rights reserved; RefDes: RefDes; Type: DEV; Local Supplier: thegioiic; Local Supplier Part Number: *; Local Supplier Link: https://www.thegioiic.com/products/cp2102
M1 = ESP8266-12F: Manufacturer: *; Manufacturer Part Number: *; Local Supplier: thegioiic; Local Supplier Link: https://www.thegioiic.com/products/esp-12f-esp8266-mach-thu-phat-wifi; Local Supplier Part Number: x
Q3 Q4 = S8050: Local Supplier: thegioiic; Local Supplier Part Number: *; Local Supplier Link: https://www.thegioiic.com/products/mmss8050-h-tp

## Nets that join several sheets
3V3: power_supply (C10.2 P5.1 U6.2 U6.4), serial (P6.2)
3V4: main (9 pins), power_supply (5 pins)
GND: main (13 pins), power_supply (16 pins), serial (5 pins), wifi (14 pins)
VBUS: power_supply (6 pins), serial (C13.2 U7.8)
ESP_TX: main (P3.2 U1.18), serial (U7.26), wifi (M1.22 U8.25)
NetJ1_2: power_supply (J1.2), serial (U7.5)
NetJ1_3: power_supply (J1.3), serial (U7.4)
NetP3_1: main (P3.1 U1.20), serial (U7.25), wifi (R21.1)
NetR17_1: main (U1.9), power_supply (R17.1 R18.2)